# EAGLE design capacitance v1 (EAGLE 9.7.0)
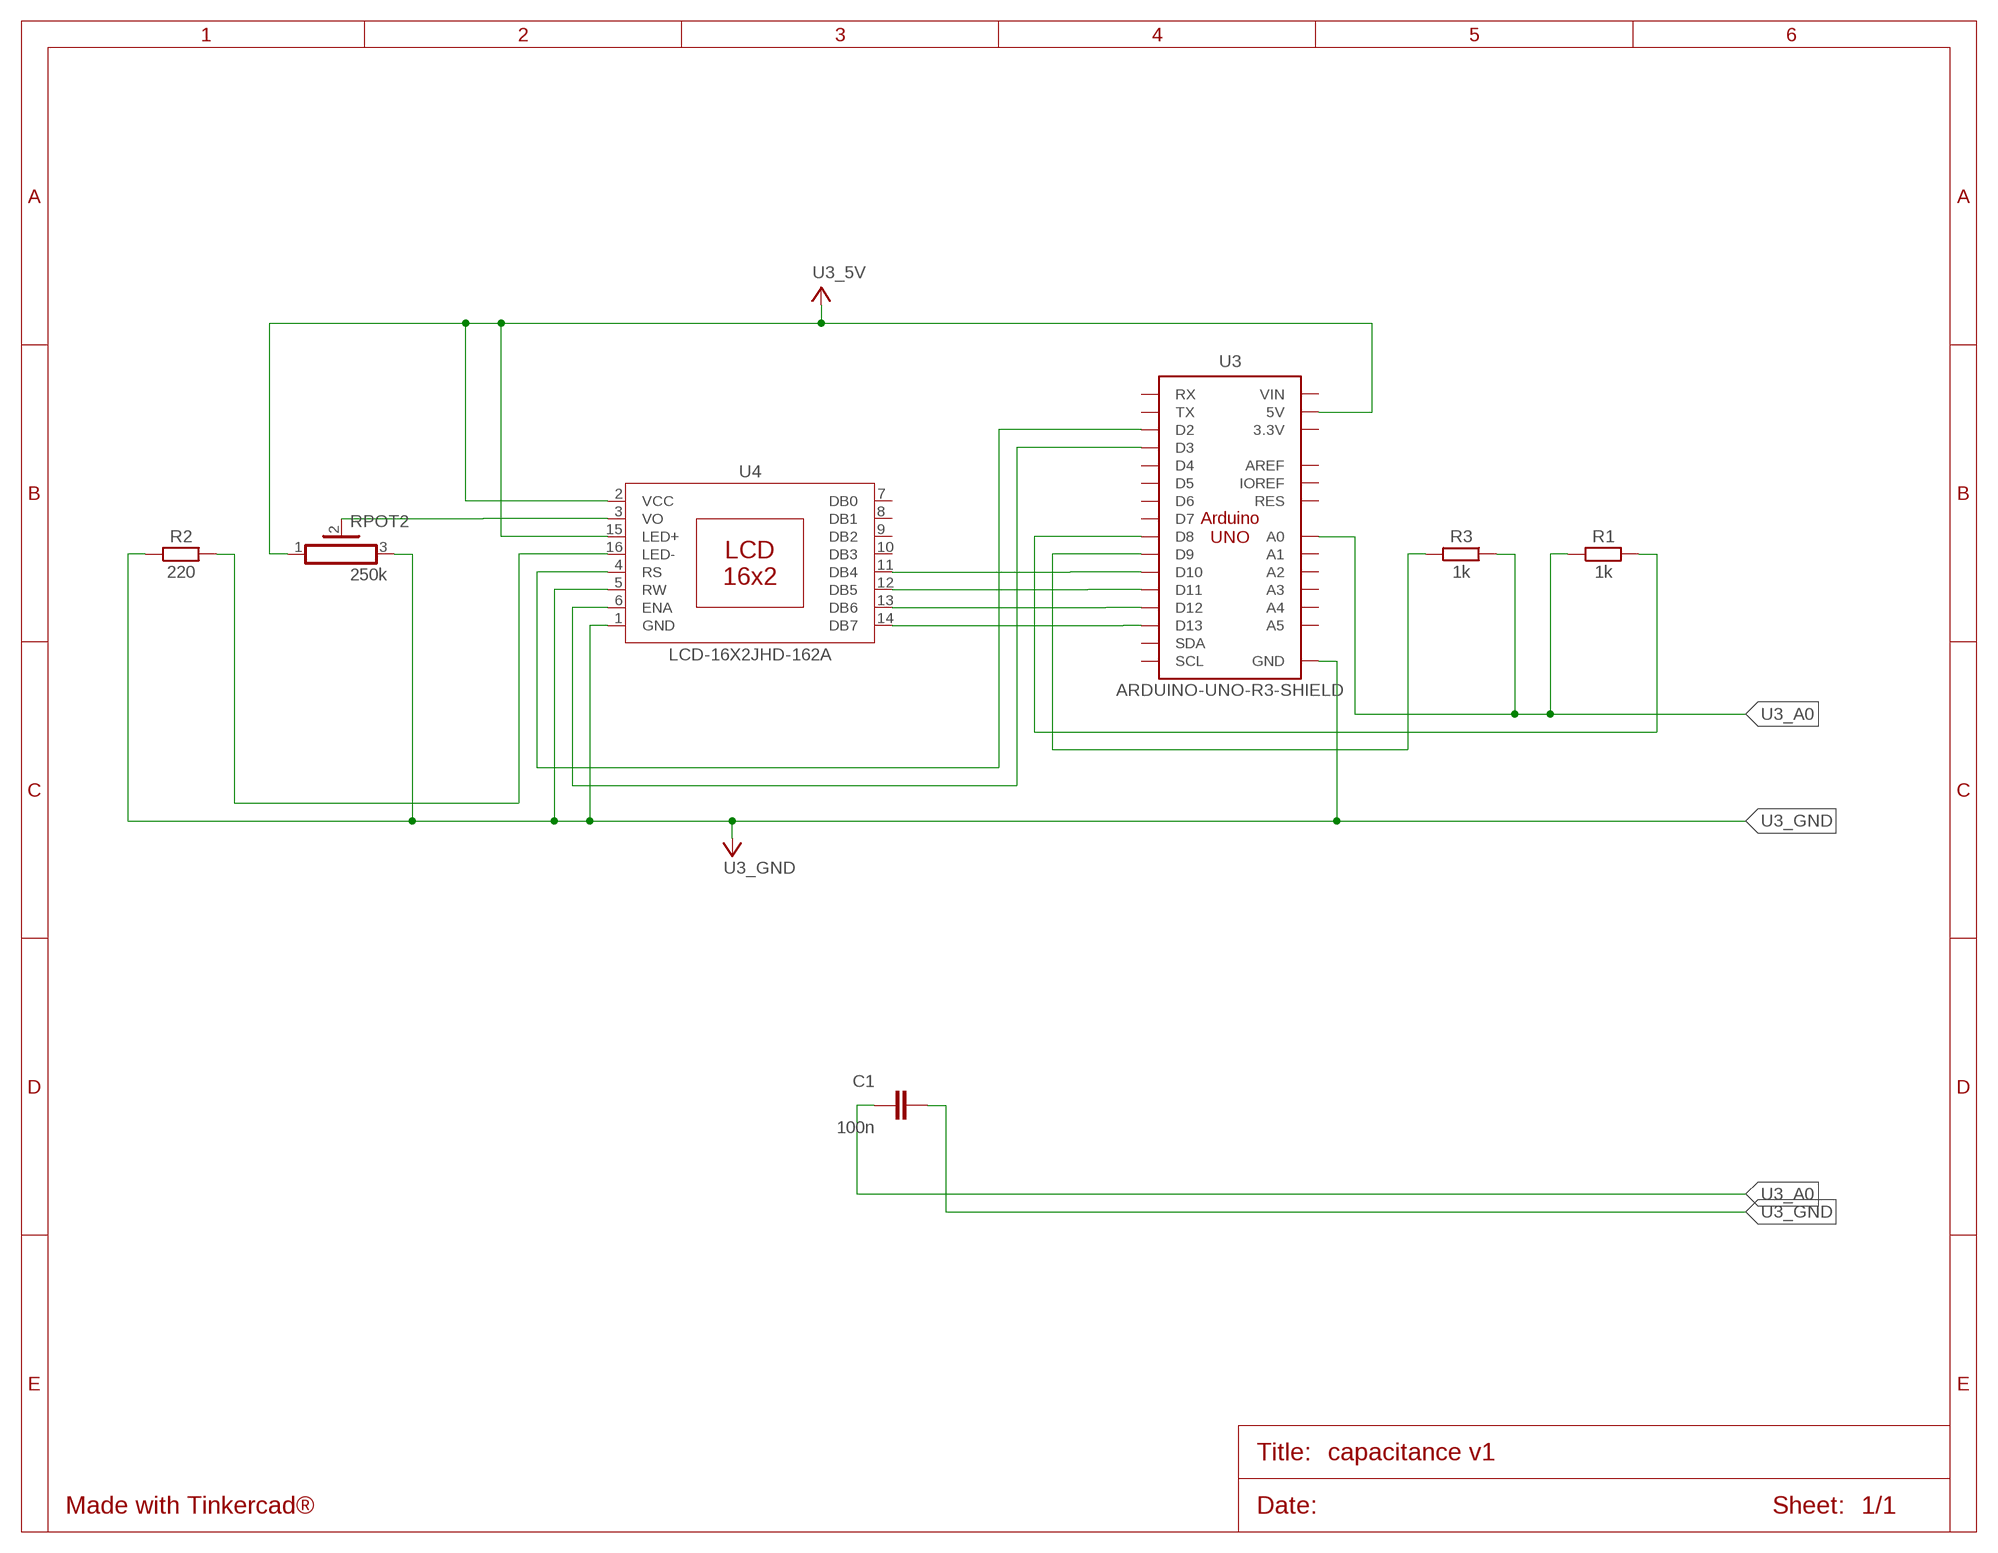
[diagram p0: schematic, sheet 1]

## Parts
C1  100n  CAPACITORCERAMIC-2.54MM  [CAP-THRU-2.54MM]
R1  1k  RESISTOR_AXIAL-10.16MM-PITCH  [RESAD1016W63L850D250B]
R2  220  RESISTOR_AXIAL-10.16MM-PITCH  [RESAD1016W63L850D250B]
R3  1k  RESISTOR_AXIAL-10.16MM-PITCH  [RESAD1016W63L850D250B]
RPOT2  250k  POT_HA-06  [HA-06-SM065]
U3  ARDUINO-UNO-R3-SHIELD  [ARDUINO-UNO-R3-SHIELD]
U4  LCD-16X2JHD-162A  [JHD-162A]

## Nets
U3_5V: RPOT2.1 U3.5V U4.2(VCC) U4.15(LED+)
U3_A0: C1.1 R1.1 R3.1 U3.A0
U3_D2: U3.D2 U4.4(RS)
U3_D3: U3.D3 U4.6(ENA)
U3_D8: R1.2 U3.D8
U3_D9: R3.2 U3.D9
U3_D10: U3.D10 U4.11(DB4)
U3_D11: U3.D11 U4.12(DB5)
U3_D12: U3.D12 U4.13(DB6)
U3_D13: U3.D13 U4.14(DB7)
U3_GND: C1.2 R2.1 RPOT2.3 U3.GND@0(GND) U3.GND@1(GND) U3.GND@2(GND) U4.1(GND) U4.5(RW)
U4_LED-: R2.2 U4.16(LED-)
U4_VO: RPOT2.2 U4.3(VO)
Unconnected: U3.3.3V U3.A1 U3.A2 U3.A3 U3.A4 U3.A5 U3.AREF U3.D4 U3.D5 U3.D6 U3.D7 U3.IOREF U3.RES U3.RX U3.SCL U3.SDA U3.TX U3.VIN U4.7(DB0) U4.8(DB1) U4.9(DB2) U4.10(DB3)

## Library data of the parts
C1 = Tinkercad:CAPACITOR: Capacitor - Generic
R1-R3 = Tinkercad:RESISTOR: Resistor Fixed - Generic
RPOT2 = Tinkercad:POT: Rectangular Trimmer Potentiometers - PV36 Series Datasheet <https://www.bourns.com/docs/Product-Datasheets/pv36.pdf>
U3 = Tinkercad:ARDUINO-UNO-R3-SHIELD
U4 = Tinkercad:LCD-16X2

## Board
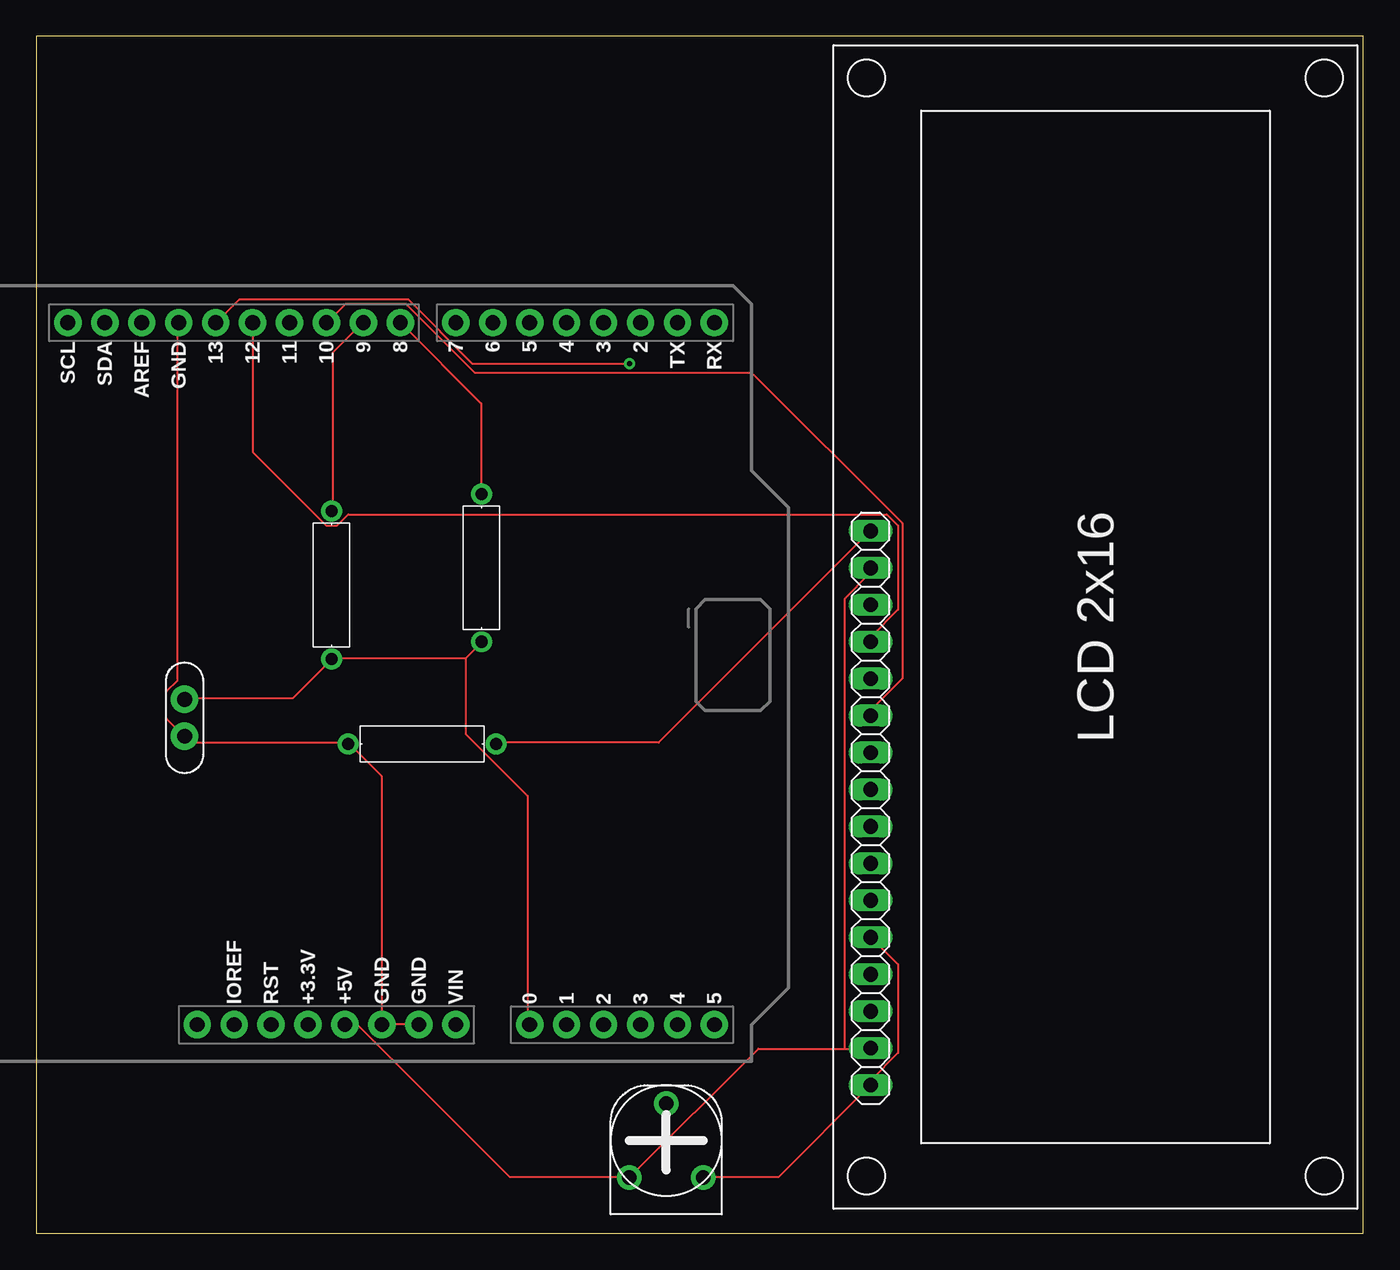
[diagram p1: board, top side]
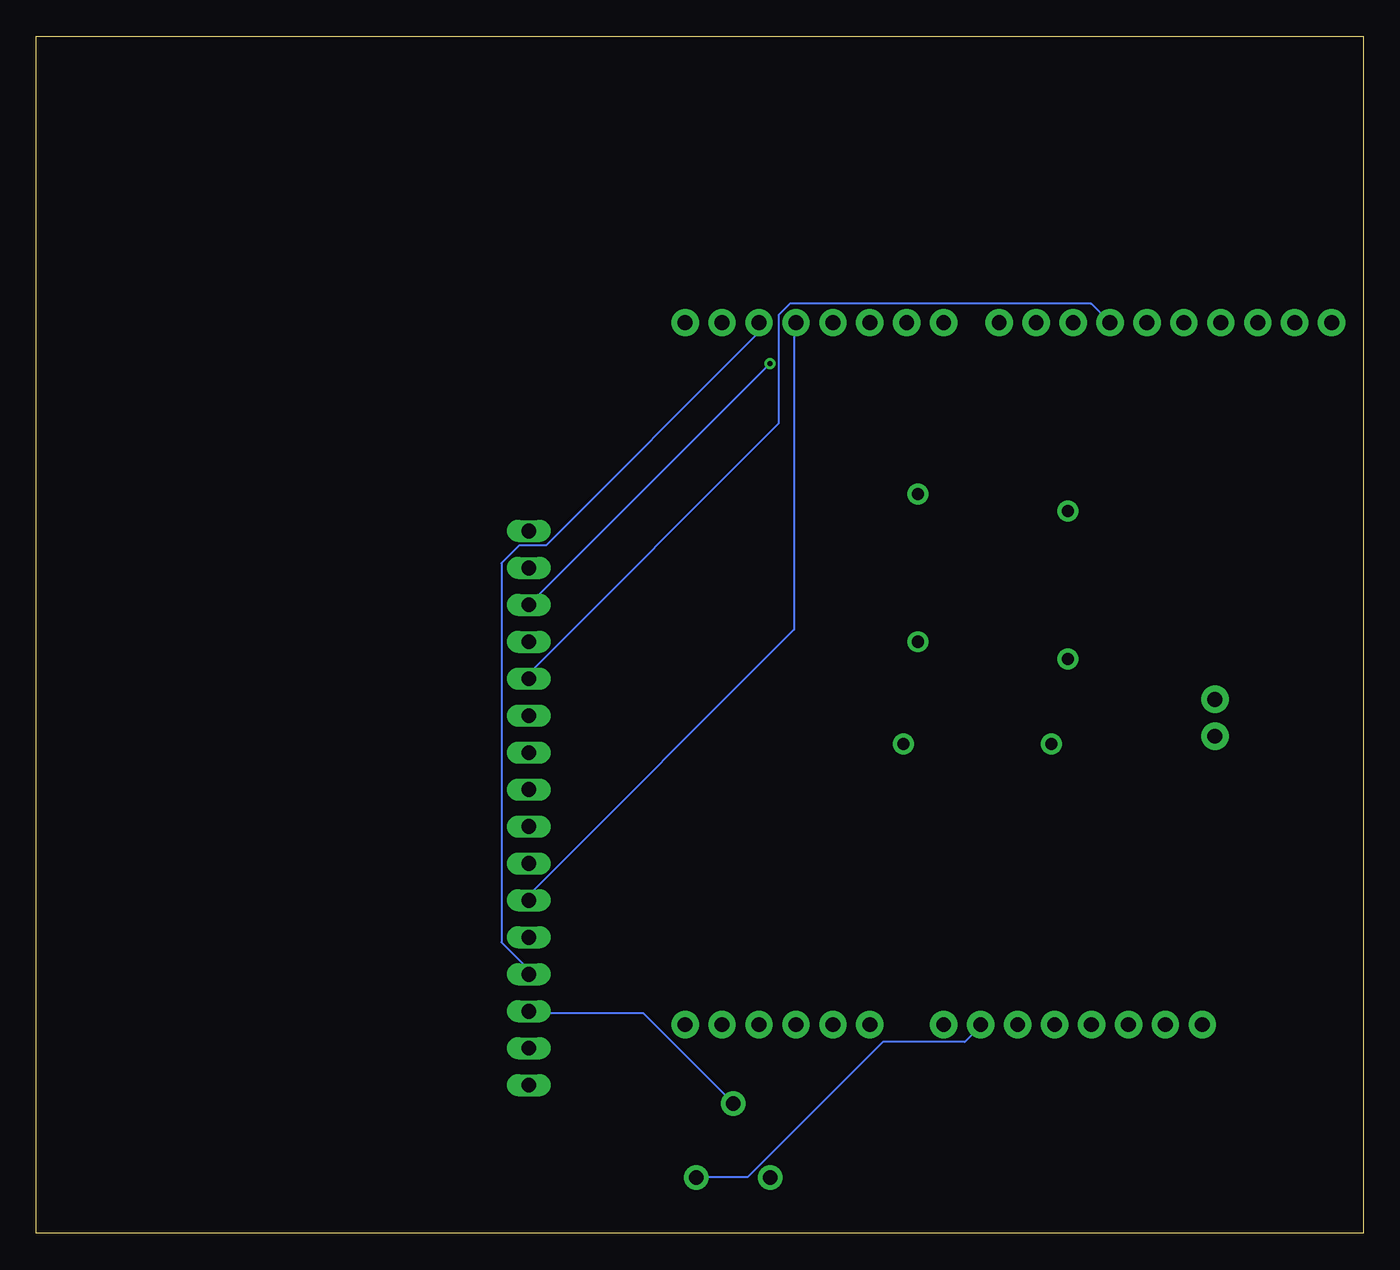
[diagram p2: board, bottom side, seen from below]

Size 91.22 x 82.29 mm. Coordinates in mm from the lower left corner, seen from the top.
Outline: 0,0 91.22,0 91.22,82.29 0,82.29 0,0
Copper layers (1*16): Top 0.035mm / dielectric 1.5mm / Bottom 0.035mm
Design rules "default": minimum track width 6mil, minimum drill 0.35mm, track to track 6mil, track to pad 6mil, pad to pad 6mil, via to via 6mil, smd to smd 6mil, copper to edge 40mil, drill to drill 6mil, minimum pad ring 10mil, minimum via ring 8mil, stop-mask expansion 4mil, vias tented up to drill 0mil, thermal gap 10mil

### Footprints (pad centres in the part's own frame; a part is rotated, then mirrored left to right if it is on the bottom)
CAP-THRU-2.54MM = drill 1.016 pad 1.88: 1 -1.27,0; 2 1.27,0
RESAD1016W63L850D250B = drill 0.83 pad 1.43: 1 -5.08,0; 2 5.08,0
HA-06-SM065 = drill 1 pad 1.676: 1 -2.54,-2.54; 2 0,2.54; 3 2.54,-2.54
ARDUINO-UNO-R3-SHIELD = drill 1.016 pad 1.88: 3.3V 24.13,-2.54; 5V 24.13,0; A0 24.13,12.7; A1 24.13,15.24; A2 24.13,17.78; A3 24.13,20.32; A4 24.13,22.86; A5 24.13,25.4; AREF -24.13,-13.97; D2 -24.13,20.32; D3 -24.13,17.78; D4 -24.13,15.24; D5 -24.13,12.7; D6 -24.13,10.16; D7 -24.13,7.62; D8 -24.13,3.81; D9 -24.13,1.27; D10 -24.13,-1.27; D11 -24.13,-3.81; D12 -24.13,-6.35; D13 -24.13,-8.89; GND@0 24.13,2.54; GND@1 24.13,5.08; GND@2 -24.13,-11.43; IOREF 24.13,-7.62; NC 24.13,-10.16; RES 24.13,-5.08; RX -24.13,25.4; SCL -24.13,-19.05; SDA -24.13,-16.51; TX -24.13,22.86; VIN 24.13,7.62
JHD-162A = drill 1.016 long: 1 -19.05,0; 2 -16.51,0; 3 -13.97,0; 4 -11.43,0; 5 -8.89,0; 6 -6.35,0; 7 -3.81,0; 8 -1.27,0; 9 1.27,0; 10 3.81,0; 11 6.35,0; 12 8.89,0; 13 11.43,0; 14 13.97,0; 15 16.51,0; 16 19.05,0

### Placement (x,y rotation side)
C1  10.19,35.44 270 top
R1  30.6,45.75 90 top
R2  26.52,33.64 0 top
R3  20.29,44.57 90 top
RPOT2  43.3,6.38 0 top
U3  21.21,38.48 270 top
U4  57.35,29.24 90 top

### Tracks (layer width: path | path; a pad name or v marks a point on that pad's centre or on a via)
U3_5V
  Top 0.152: 55.58,12.7 49.63,12.7 40.79,3.86 RPOT2.1 40.64,3.86 32.56,3.86 22.2,14.22 21.29,14.22 U3.5V | 55.58,12.7 57.25,12.7 U4.2 | 55.58,12.7 55.58,43.64 57.25,45.31 57.25,45.62 U4.15
U3_A0
  Top 0.152: 29.51,39.52 20.37,39.52 R3.1 20.22,39.37 17.63,36.78 10.31,36.78 C1.1 | 29.51,39.52 30.58,40.59 R1.1 | 29.51,39.52 29.51,34.34 33.78,30.07 33.78,14.38 U3.A0
U3_D2
  Bottom 0.152: U4.4 57.4,17.88 57.4,18.19 59.23,20.01 59.23,46.08 58.01,47.3 56.19,47.3 41.55,61.92 41.55,62.53 U3.D2
U3_D3
  Bottom 0.152: U4.6 57.25,22.91 57.25,23.37 39.12,41.5 39.12,62.53 U3.D3
U3_D8
  Top 0.152: R1.2 30.58,50.95 30.58,57.05 25.09,62.53 U3.D8
U3_D9
  Top 0.152: R3.2 20.37,49.73 20.37,60.55 22.35,62.53 U3.D9
U3_D10
  Top 0.152: U4.11 57.4,35.71 57.4,36.02 59.54,38.15 59.54,48.82 49.17,59.18 30.12,59.18 25.4,63.91 21.29,63.91 20.07,62.69 U3.D10
U3_D11
  Bottom 0.152: U4.12 57.25,38.15 57.25,38.61 40.18,55.68 40.18,63.14 39.42,63.91 18.69,63.91 17.47,62.69 U3.D11
U3_D12
  Top 0.152: U4.13 57.4,40.74 57.4,41.05 59.23,42.88 59.23,48.67 58.47,49.43 21.44,49.43 20.68,48.67 19.91,48.67 14.88,53.7 14.88,62.53 U3.D12
U3_D13  (via drill 0.35)
  Top 0.152: v40.79,59.79 29.97,59.79 25.55,64.21 13.97,64.21 12.45,62.69 U3.D13
  Bottom 0.152: v40.79,59.79 57.25,43.33 U4.14
U3_GND
  Top 0.152: U4.5 57.4,20.32 59.23,18.49 59.23,12.39 57.4,10.57 57.4,10.26 U4.1 57.25,10.11 51,3.86 45.97,3.86 RPOT2.3 | U3.GND@1 26.16,14.38 23.88,14.38 U3.GND@0 23.72,14.38 23.72,31.44 21.59,33.58 R2.1 21.44,33.73 10.62,33.73 10.31,34.04 C1.2 10.16,34.19 8.94,35.41 8.94,37.24 9.7,38 9.7,62.53 U3.GND@2
  Bottom 0.152: RPOT2.3 45.82,3.86 42.32,3.86 33.02,13.16 27.38,13.16 26.31,14.22 U3.GND@1
U4_LED-
  Top 0.152: R2.2 31.65,33.73 42.77,33.73 57.25,48.21 U4.16
U4_VO
  Bottom 0.152: U4.3 57.25,15.14 49.48,15.14 43.38,9.04 RPOT2.2